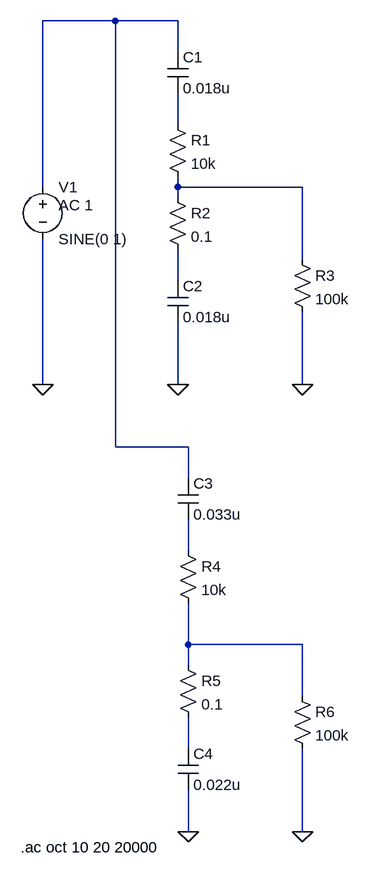
[diagram p0: schematic BD-2 OD-3 Tone (1).asc]
BD-2 OD-3 Tone (1).asc, the LTspice schematic file:
Version 4
SHEET 1 880 920
WIRE 192 -368 80 -368
WIRE 288 -368 192 -368
WIRE 288 -320 288 -368
WIRE 288 -208 288 -256
WIRE 80 -112 80 -368
WIRE 288 -112 288 -128
WIRE 480 -112 288 -112
WIRE 288 -96 288 -112
WIRE 480 0 480 -112
WIRE 288 32 288 -16
WIRE 80 192 80 -32
WIRE 288 192 288 96
WIRE 480 192 480 80
WIRE 192 288 192 -368
WIRE 304 288 192 288
WIRE 304 336 304 288
WIRE 304 448 304 400
WIRE 304 592 304 528
WIRE 480 592 304 592
WIRE 304 624 304 592
WIRE 480 672 480 592
WIRE 304 752 304 704
WIRE 304 880 304 816
WIRE 480 880 480 752
FLAG 80 192 0
FLAG 288 192 0
FLAG 304 880 0
FLAG 480 192 0
FLAG 480 880 0
SYMBOL cap 272 -320 R0
SYMATTR InstName C1
SYMATTR Value 0.018u
SYMBOL cap 272 32 R0
SYMATTR InstName C2
SYMATTR Value 0.018u
SYMBOL res 272 -224 R0
SYMATTR InstName R1
SYMATTR Value 10k
SYMBOL res 272 -112 R0
SYMATTR InstName R2
SYMATTR Value 0.1
SYMBOL res 464 -16 R0
SYMATTR InstName R3
SYMATTR Value 100k
SYMBOL voltage 80 -128 R0
WINDOW 123 24 44 Left 2
WINDOW 39 0 0 Left 2
SYMATTR InstName V1
SYMATTR Value SINE(0 1)
SYMATTR Value2 AC 1
SYMBOL cap 288 336 R0
SYMATTR InstName C3
SYMATTR Value 0.033u
SYMBOL cap 288 752 R0
SYMATTR InstName C4
SYMATTR Value 0.022u
SYMBOL res 288 432 R0
SYMATTR InstName R4
SYMATTR Value 10k
SYMBOL res 288 608 R0
SYMATTR InstName R5
SYMATTR Value 0.1
SYMBOL res 464 656 R0
SYMATTR InstName R6
SYMATTR Value 100k
TEXT 46 904 Left 2 !.ac oct 10 20 20000

The netlist it stands for:
* BD-2 OD-3 Tone (1).asc
C1 N001 N002 0.018u
C2 N004 0 0.018u
R1 N002 N003 10k
R2 N003 N004 0.1
R3 N003 0 100k
V1 N001 0 SINE(0 1) AC 1
C3 N001 N005 0.033u
C4 N007 0 0.022u
R4 N005 N006 10k
R5 N006 N007 0.1
R6 N006 0 100k
.ac oct 10 20 20000
.backanno
.end